# Altium schematic sheet Arduino_ Connectors.SchDoc: Arduino Uno connector
size A4; Date: 9/24/2014; Author: P.A.; CompanyName: STMicroelectronics; Organization: Microcontrollers Division; Address1: 12, Rue Jules HOROWITZ; Address2: 38019 Grenoble; Address3: FRANCE; DocumentNumber: MB1189; Revision: B-07; SheetNumber: 12; SheetTotal: 13; Project: STM32F469I-DISCO
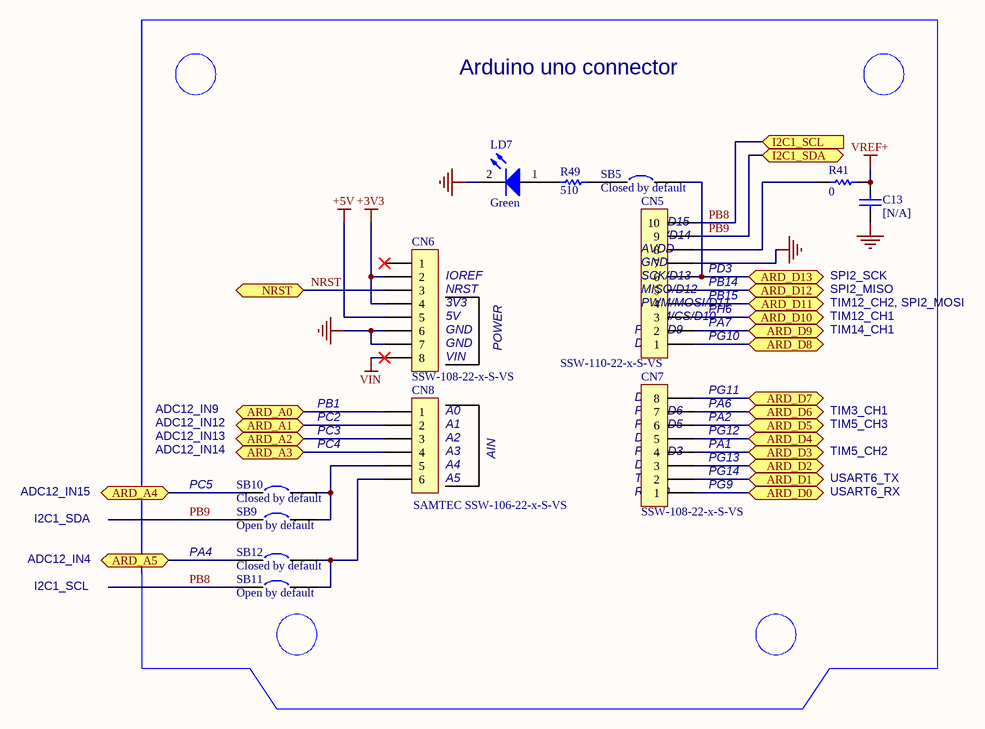
[diagram p0: Arduino_ Connectors.SchDoc]

## Parts
C13  [N/A]  [0603C]
CN5  SSW-110-22-x-S-VS  [SSW-110-22-X-S-VS]
CN6  SSW-108-22-x-S-VS  [SSW-108-22-X-S-VS]
CN7  SSW-108-22-x-S-VS  [SSW-108-22-X-S-VS]
CN8  SAMTEC SSW-106-22-x-S-VS  [SSW-106-22-X-S-VS]
LD7  Green  [0603D]
R41  0  [0603R]
R49  510  [0603R]
SB5  Closed by default  [SB_0603]
SB9  Open by default  [SB_0603]
SB10  Closed by default  [SB_0603]
SB11  Open by default  [SB_0603]
SB12  Closed by default  [SB_0603]

## Ports
ARD_A0 (bidir), ARD_A1 (bidir), ARD_A2 (bidir), ARD_A3 (bidir), ARD_A4 (bidir), ARD_A5 (bidir), ARD_D0 (bidir), ARD_D1 (bidir), ARD_D2 (bidir), ARD_D3 (bidir), ARD_D4 (bidir), ARD_D5 (bidir), ARD_D6 (bidir), ARD_D7 (bidir), ARD_D8 (bidir), ARD_D9 (bidir), ARD_D10 (bidir), ARD_D11 (bidir), ARD_D12 (bidir), ARD_D13 (bidir), I2C1_SCL (in), I2C1_SDA (bidir), NRST (bidir)

## Nets
+3V3: CN6.2 CN6.4
+5V: CN6.5
GND: C13.1 CN5.7 CN6.6 CN6.7 LD7.2(K)
VIN: CN6.8
VREF+: C13.2 R41.1
ARD_A0: CN8.1 ; port ARD_A0
ARD_A1: CN8.2 ; port ARD_A1
ARD_A2: CN8.3 ; port ARD_A2
ARD_A3: CN8.4 ; port ARD_A3
ARD_A4: SB10.1 ; port ARD_A4
ARD_A5: SB12.1 ; port ARD_A5
ARD_D0: CN7.1 ; port ARD_D0
ARD_D1: CN7.2 ; port ARD_D1
ARD_D2: CN7.3 ; port ARD_D2
ARD_D3: CN7.4 ; port ARD_D3
ARD_D4: CN7.5 ; port ARD_D4
ARD_D5: CN7.6 ; port ARD_D5
ARD_D6: CN7.7 ; port ARD_D6
ARD_D7: CN7.8 ; port ARD_D7
ARD_D8: CN5.1 ; port ARD_D8
ARD_D9: CN5.2 ; port ARD_D9
ARD_D10: CN5.3 ; port ARD_D10
ARD_D11: CN5.4 ; port ARD_D11
ARD_D12: CN5.5 ; port ARD_D12
ARD_D13: CN5.6 SB5.2 ; port ARD_D13
NRST: CN6.3 ; port NRST
PB8: CN5.10 SB11.1 ; port I2C1_SCL
PB9: CN5.9 SB9.1 ; port I2C1_SDA
NetCN5_8: CN5.8 R41.2
NetCN8_5: CN8.5 SB9.2 SB10.2
NetCN8_6: CN8.6 SB11.2 SB12.2
NetLD7_1: LD7.1(A) R49.2
NetR49_1: R49.1 SB5.1

Not connected (* = marked no-connect by the designer): CN6 1*

## Notes on the sheet
- Arduino uno connector
- (near CN5) SDA/D14
- SCL/D15
- (near CN5) AVDD
- (near CN6) IOREF
- (near CN6) NRST
- (near CN6) 3V3
- (near CN5) SCK/D13
- (near CN5) MISO/D12
- (near CN5) PWM/MOSI/D11
- (near CN5) GND
- (near CN5) PH6
- (near CN5) PB15
- (near CN5) PB14
- (near CN5) PD3
- TIM12_CH2, SPI2_MOSI
- SPI2_MISO
- SPI2_SCK
- (near CN6) 5V
- (near CN6) GND
- (near CN6) VIN
- POWER
- (near CN5) D8
- (near CN5) PWM/D9
- (near CN5) PWM/CS/D10
- (near CN5) PG10
- (near CN5) PA7
- TIM14_CH1
- TIM12_CH1
- ADC12_IN14
- ADC12_IN13
- ADC12_IN12
- ADC12_IN9
- PB1
- PC2
- PC3
- PC4
- (near CN8) A0
- (near CN8) A1
- (near CN8) A2
- (near CN7) D4
- (near CN7) PWM/D5
- (near CN7) PWM/D6
- (near CN7) D7
- (near CN7) PA1
- (near CN7) PG12
- (near CN7) PA2
- (near CN7) PA6
- PG11
- TIM5_CH3
- TIM3_CH1
- ADC12_IN15
- I2C1_SDA
- PC5
- (near CN8) A3
- (near CN8) A4
- (near CN8) A5
- AIN
- (near CN7) RX/D0
- (near CN7) TX/D1
- (near CN7) D2
- (near CN7) PWM/D3
- (near CN7) PG9
- (near CN7) PG14
- (near CN7) PG13
- USART6_RX
- USART6_TX
- TIM5_CH2
- ADC12_IN4
- PA4
- I2C1_SCL
- Title:
- Project:
- Size:
- Revision:
- Variant:
- -
- Date:
- Reference:
- Sheet:
- of

## Library data of the parts
C13 = Cap: Capacitor; Value: 10nF; Ordered by: Subcon; Fitted: NO; Published: 8-Jun-2000; Revision: July-2002: Re-released for DXP Platform.; Publisher: Altium Limited
CN5 = Header 10X1_Female: Header, 10-Pin, Single row,female; Manuf_1: SAMTEC; Ordered by: Subcon; Silkscreen: pin names as in schematic; LatestRevisionDate: 17-Jul-2002; LatestRevisionNote: Re-released for DXP Platform.; Publisher: Altium Limited; Manuf_Part_1: SSW-110-22-x-S-VS
CN6 CN7 = Header 8X1_Female: Header, 8-Pin, Single row,female; Manuf_1: SAMTEC; Ordered by: Subcon; Silkscreen: pin names as in schematic; LatestRevisionDate: 17-Jul-2002; LatestRevisionNote: Re-released for DXP Platform.; Publisher: Altium Limited; Manuf_Part_1: SSW-108-22-x-S-VS
CN8 = Header 6X1_Female: Header, 6-Pin, Single row,female SMD; Ordered by: Subcon; Silkscreen: pin names as in schematic; LatestRevisionDate: 17-Jul-2002; LatestRevisionNote: Re-released for DXP Platform.; Publisher: Altium Limited; Manuf_1: SAMTEC; Manuf_Part_1: SSW-106-22-x-S-VS
LD7 = LED2: Typical RED, GREEN, YELLOW, AMBER GaAs LED; Manuf_1: Everlight Electronics; Manuf_part_1: 19-217/G7C-AN1P2/3T; Ordered by: Subcon; ECCN_US/EU: EAR99/NEC; Published: 8-Jun-2000; Revision: July-2002: Re-released for DXP Platform.; Publisher: Altium Limited
R41 = Res1: Resistor; Manuf_1: YAGEO; Manuf_part_1: RC0603JR-070RL; Ordered by: Subcon; Published: 8-Jun-2000; Revision: July-2002: Re-released for DXP Platform.; Publisher: Altium Limited; Value: 0
R49 = Res1: Resistor; Manuf_1: YAGEO; Manuf_part_1: RC0603FR-07510RL; Ordered by: Subcon; Published: 8-Jun-2000; Revision: July-2002: Re-released for DXP Platform.; Publisher: Altium Limited; Value: 510
SB5 SB10 SB12 = Circuit Breaker: Ordered by: Subcon; Comments: Solder bridge; Published: 24-Mar-1999; Revision: July-2002: Re-released for DXP Platform.; Publisher: Altium Limited
SB9 SB11 = Circuit Breaker: Ordered by: Subcon; Comments: Solder bridge; Solder: NO; Published: 24-Mar-1999; Revision: July-2002: Re-released for DXP Platform.; Publisher: Altium Limited